# EAGLE design EPaperDisplayUnit (EAGLE 7.5.0)
GCN: 1.0; PCBNAME: EPaperDisplayUnit; PROJECT: EPaperDisplayUnit

## Sheet 1 of 2
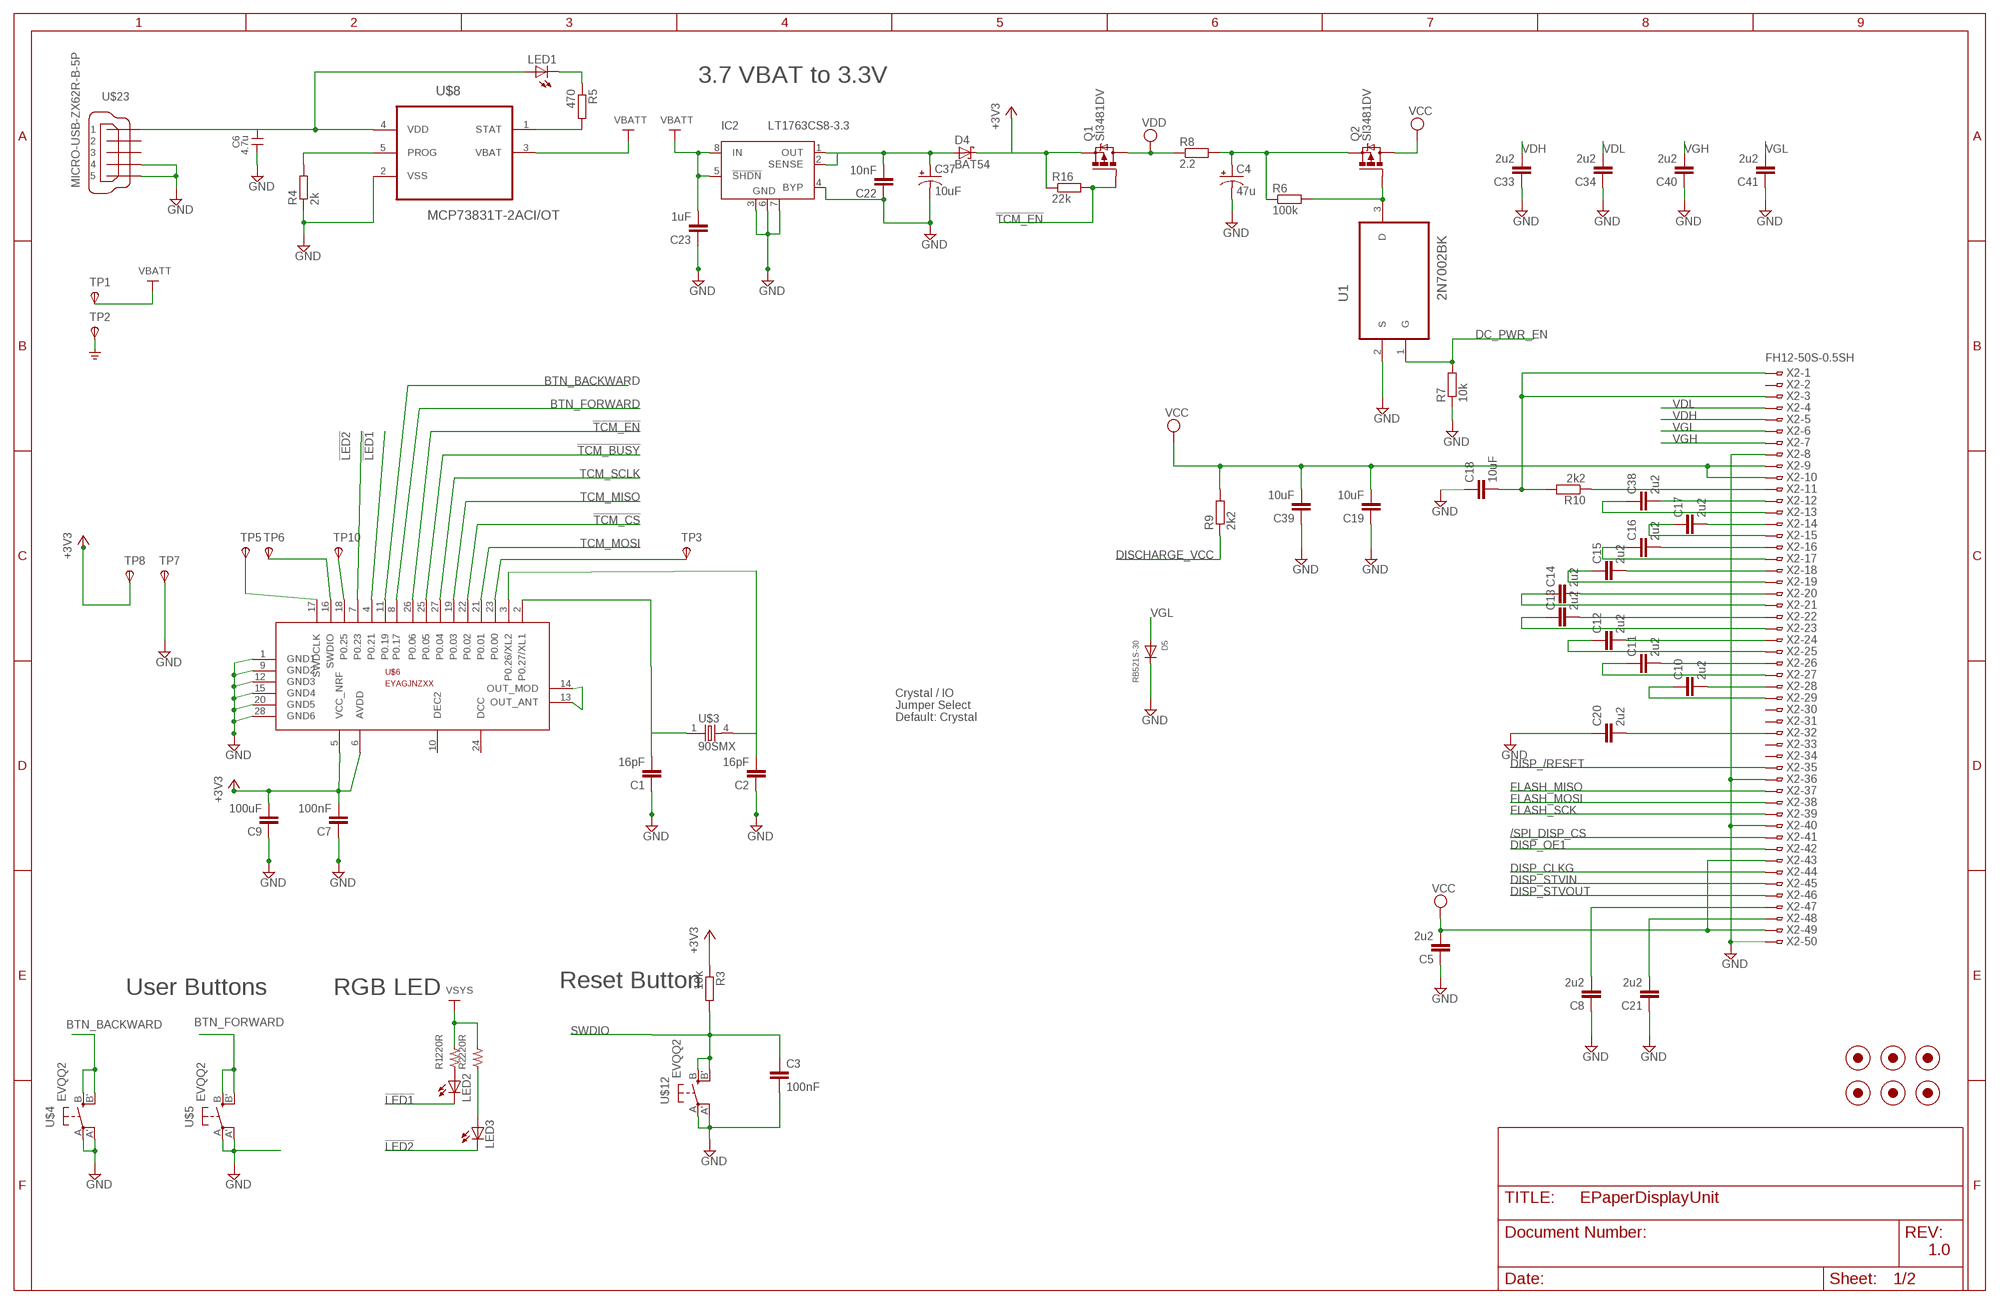
[diagram p0: schematic, sheet 1]

### Parts
C1  16pF  C-EUC0402  [C0402]
C2  16pF  C-EUC0402  [C0402]
C3  100nF  C-EUC0603  [C0603]
C4  47u  CPOL-USB/3528-21R  [B/3528-21R]
C5  2u2  C-EUC0402  [C0402]
C6  4.7u  C-0603  [SMD0603]
C7  100nF  C-EUC0402  [C0402]
C8  2u2  C-EUC0402  [C0402]
C9  100uF  C-EUC0402  [C0402]
C10  2u2  C-EUC0402  [C0402]
C11  2u2  C-EUC0402  [C0402]
C12  2u2  C-EUC0402  [C0402]
C13  2u2  C-EUC0402  [C0402]
C14  2u2  C-EUC0402  [C0402]
C15  2u2  C-EUC0402  [C0402]
C16  2u2  C-EUC0402  [C0402]
C17  2u2  C-EUC0402  [C0402]
C18  10uF  C-EUC0402  [C0402]
C19  10uF  C-EUC0402  [C0402]
C20  2u2  C-EUC0402  [C0402]
C21  2u2  C-EUC0402  [C0402]
C22  10nF  C-EUC0402  [C0402]
C23  1uF  C-EUC0402  [C0402]
C33  2u2  C-EUC0402  [C0402]
C34  2u2  C-EUC0402  [C0402]
C37  10uF  CPOL-US085CS-1AR  [085CS_1AR]
C38  2u2  C-EUC0402  [C0402]
C39  10uF  C-EUC0402  [C0402]
C40  2u2  C-EUC0402  [C0402]
C41  2u2  C-EUC0402  [C0402]
D4  BAT54  [SOT23]
D5  RB521S-30  DIODESOD-523  [SOD-523]
FID1  FIDUCIAL-.04  [FIDUCIAL-.04]
FID2  FIDUCIAL-.04  [FIDUCIAL-.04]
FID3  FIDUCIAL-.04  [FIDUCIAL-.04]
FID4  FIDUCIAL-.04  [FIDUCIAL-.04]
FID5  FIDUCIAL-.04  [FIDUCIAL-.04]
FID6  FIDUCIAL-.04  [FIDUCIAL-.04]
IC2  LT1763CS8-3.3  [SOIC8]
LED1  LEDCHIPLED_0603  [CHIPLED_0603]
LED2  LEDCHIP-LED0603  [CHIP-LED0603]
LED3  LEDCHIP-LED0603  [CHIP-LED0603]
Q1  SI3481DV  [TSOP-6.PAC]
Q2  SI3481DV  [TSOP-6.PAC]
R1  220R  R-0402  [SMD0402]
R2  220R  R-0402  [SMD0402]
R3  10k  R-EU_R0402  [R0402]
R4  2k  R-EU_R0402  [R0402]
R5  470  R-EU_R0402  [R0402]
R6  100k  R-EU_R0402  [R0402]
R7  10k  R-EU_R0402  [R0402]
R8  2.2  R-EU_R0402  [R0402]
R9  2k2  R-EU_R0402  [R0402]
R10  2k2  R-EU_R0402  [R0402]
R16  22k  R-EU_R0402  [R0402]
TP1  TPSPAD1-13Y  [P1-13Y]
TP2  TPSPAD1-13Y  [P1-13Y]
TP3  TPSPAD1-13Y  [P1-13Y]
TP5  TPSPAD1-13Y  [P1-13Y]
TP6  TPSPAD1-13Y  [P1-13Y]
TP7  TPSPAD1-13Y  [P1-13Y]
TP8  TPSPAD1-13Y  [P1-13Y]
TP10  TPSPAD1-13Y  [P1-13Y]
U1  2N7002BK  [SOT95P230X110-3N]
U$3  90SMX  [9XSMX]
U$4  EVQQ2  [EVQ-Q2]
U$5  EVQQ2  [EVQ-Q2]
U$6  EYAGJNZXXEYAGJNZXX  [EYAGJNZXX]
U$8  MCP73831T-2ACI/OT  [SOT95P280X145-5N]
U$12  EVQQ2  [EVQ-Q2]
U$23  MICRO-USB-ZX62R-B-5P  [ZX62R-B-5P]
X2  FH12-50S-0.5SH  [FH12-50S-0.5SH]

### Nets
!LED1: LED2.C U$6.4(P0.21)
!LED2: LED3.C U$6.7(P0.23)
!TCM_BUSY: U$6.25(P0.05) ; also sheet 2
!TCM_CS: U$6.22(P0.02) ; also sheet 2
!TCM_EN: Q1.3(G) R16.2 U$6.26(P0.06)
+3V3: C7.2 C9.2 D4.3(C) Q1.4(S) R3.1 R16.1 TP8.TP(PP) U$6.5(VCC_NRF) U$6.6(AVDD)
/SPI_DISP_CS: X2.41 ; also sheet 2
BTN_BACKWARD: U$4.B'(S1) U$4.B(S) U$6.11(P0.19)
BTN_FORWARD: U$5.B'(S1) U$5.B(S) U$6.8(P0.17)
DC_PWR_EN: R7.2 U1.1(G) ; also sheet 2
DISCHARGE_VCC: R9.1 ; also sheet 2
DISP_/RESET: X2.35 ; also sheet 2
DISP_CLKG: X2.44 ; also sheet 2
DISP_OE1: X2.42 ; also sheet 2
DISP_STVIN: X2.45 ; also sheet 2
DISP_STVOUT: X2.46 ; also sheet 2
FLASH_MISO: X2.37 ; also sheet 2
FLASH_MOSI: X2.38 ; also sheet 2
FLASH_SCK: X2.39 ; also sheet 2
GND [Planes]: C1.1 C2.1 C3.2 C4.- C5.1 C6.2 C7.1 C8.1 C9.1 C18.1 C19.1 C20.1 C21.1 C22.1 C23.1 C33.1 C34.1 C37.- C39.1 C40.1 C41.1 D5.K(C) IC2.3(GND) IC2.4(BYP) IC2.6(GND) IC2.7(GND) R4.1 R7.1 TP2.TP(PP) TP7.TP(PP) U$4.A'(P1) U$4.A(P) U$5.A'(P1) U$5.A(P) U$6.1(GND1) U$6.9(GND2) U$6.12(GND3) U$6.15(GND4) U$6.20(GND5) U$6.28(GND6) U$8.2(VSS) U$12.A'(P1) U$12.A(P) U$23.4 U$23.5 X2.8 X2.36 X2.40 X2.50 ; also sheet 2
N$1: TP10.TP(PP) U$6.18(P0.25)
N$5: C6.1 LED1.A U$8.4(VDD) U$23.1
N$6: C22.2 C37.+ D4.1(A) IC2.1(OUT) IC2.2(SENSE)
N$7: R4.2 U$8.5(PROG)
N$8: LED1.C R5.1
N$9 [Planes]: C20.2 X2.32
N$10: R5.2 U$8.1(STAT)
N$11: Q2.3(G) R6.2 U1.3(D)
N$12: C4.+ Q2.4(S) R6.1 R8.2
N$13: C10.1 X2.29
N$14: C10.2 X2.28
N$15: C11.1 X2.27
N$16: C11.2 X2.26
N$17: C12.1 X2.25
N$18: C12.2 X2.24
N$19: C2.2 U$3.4 U$6.3(P0.26/XL2)
N$20: C1.2 U$3.1 U$6.2(P0.27/XL1)
N$21: C13.1 X2.23
N$22: C13.2 X2.22
N$24: C14.1 X2.21
N$25: C14.2 X2.20
N$26: C15.1 X2.19
N$27: C16.1 X2.17
N$28: C16.2 X2.16
N$29: C17.1 X2.15
N$30: C17.2 X2.14
N$31: C38.1 X2.13
N$32: C38.2 X2.12
N$33: LED2.A R1.1
N$34: LED3.A R2.1
N$36: C18.2 R10.2 X2.1 X2.3
N$37: R10.1 X2.11
N$38: TP3.TP(PP) U$6.23(P0.00)
N$39: C15.2 X2.18
N$44: U$6.13(OUT_ANT) U$6.14(OUT_MOD)
SWCLK: TP5.TP(PP) U$6.17(SWDCLK)
SWDIO: C3.1 R3.2 TP6.TP(PP) U$6.16(SWDIO) U$12.B'(S1) U$12.B(S)
TCM_MISO: U$6.19(P0.03) ; also sheet 2
TCM_MOSI: U$6.21(P0.01) ; also sheet 2
TCM_SCLK: U$6.27(P0.04) ; also sheet 2
VBATT: C23.2 IC2.5(!SHDN) IC2.8(IN) TP1.TP(PP) U$8.3(VBAT)
VCC: C5.2 C19.2 C39.2 Q2.1(D) Q2.2(D) Q2.5(D) Q2.6(D) R9.2 X2.9 X2.10 X2.43 X2.49
VDD: Q1.1(D) Q1.2(D) Q1.5(D) Q1.6(D) R8.1 ; also sheet 2
VDH: C33.2 X2.5
VDL: C34.2 X2.4
VGH: C21.2 C40.2 X2.7 X2.48
VGL: C8.2 C41.2 D5.A X2.6 X2.47
VSYS: R1.2 R2.2
Unconnected: U1.2(S) U$6.10(DEC2) U$6.24(DCC) U$23.2 U$23.3 X2.2 X2.30 X2.31 X2.33 X2.34

### Notes on the sheet
- 3.7 VBAT to 3.3V
- Crystal / IO
  Jumper Select
  Default: Crystal
- User Buttons | RGB LED | Reset Button
- 1.0

## Sheet 2 of 2
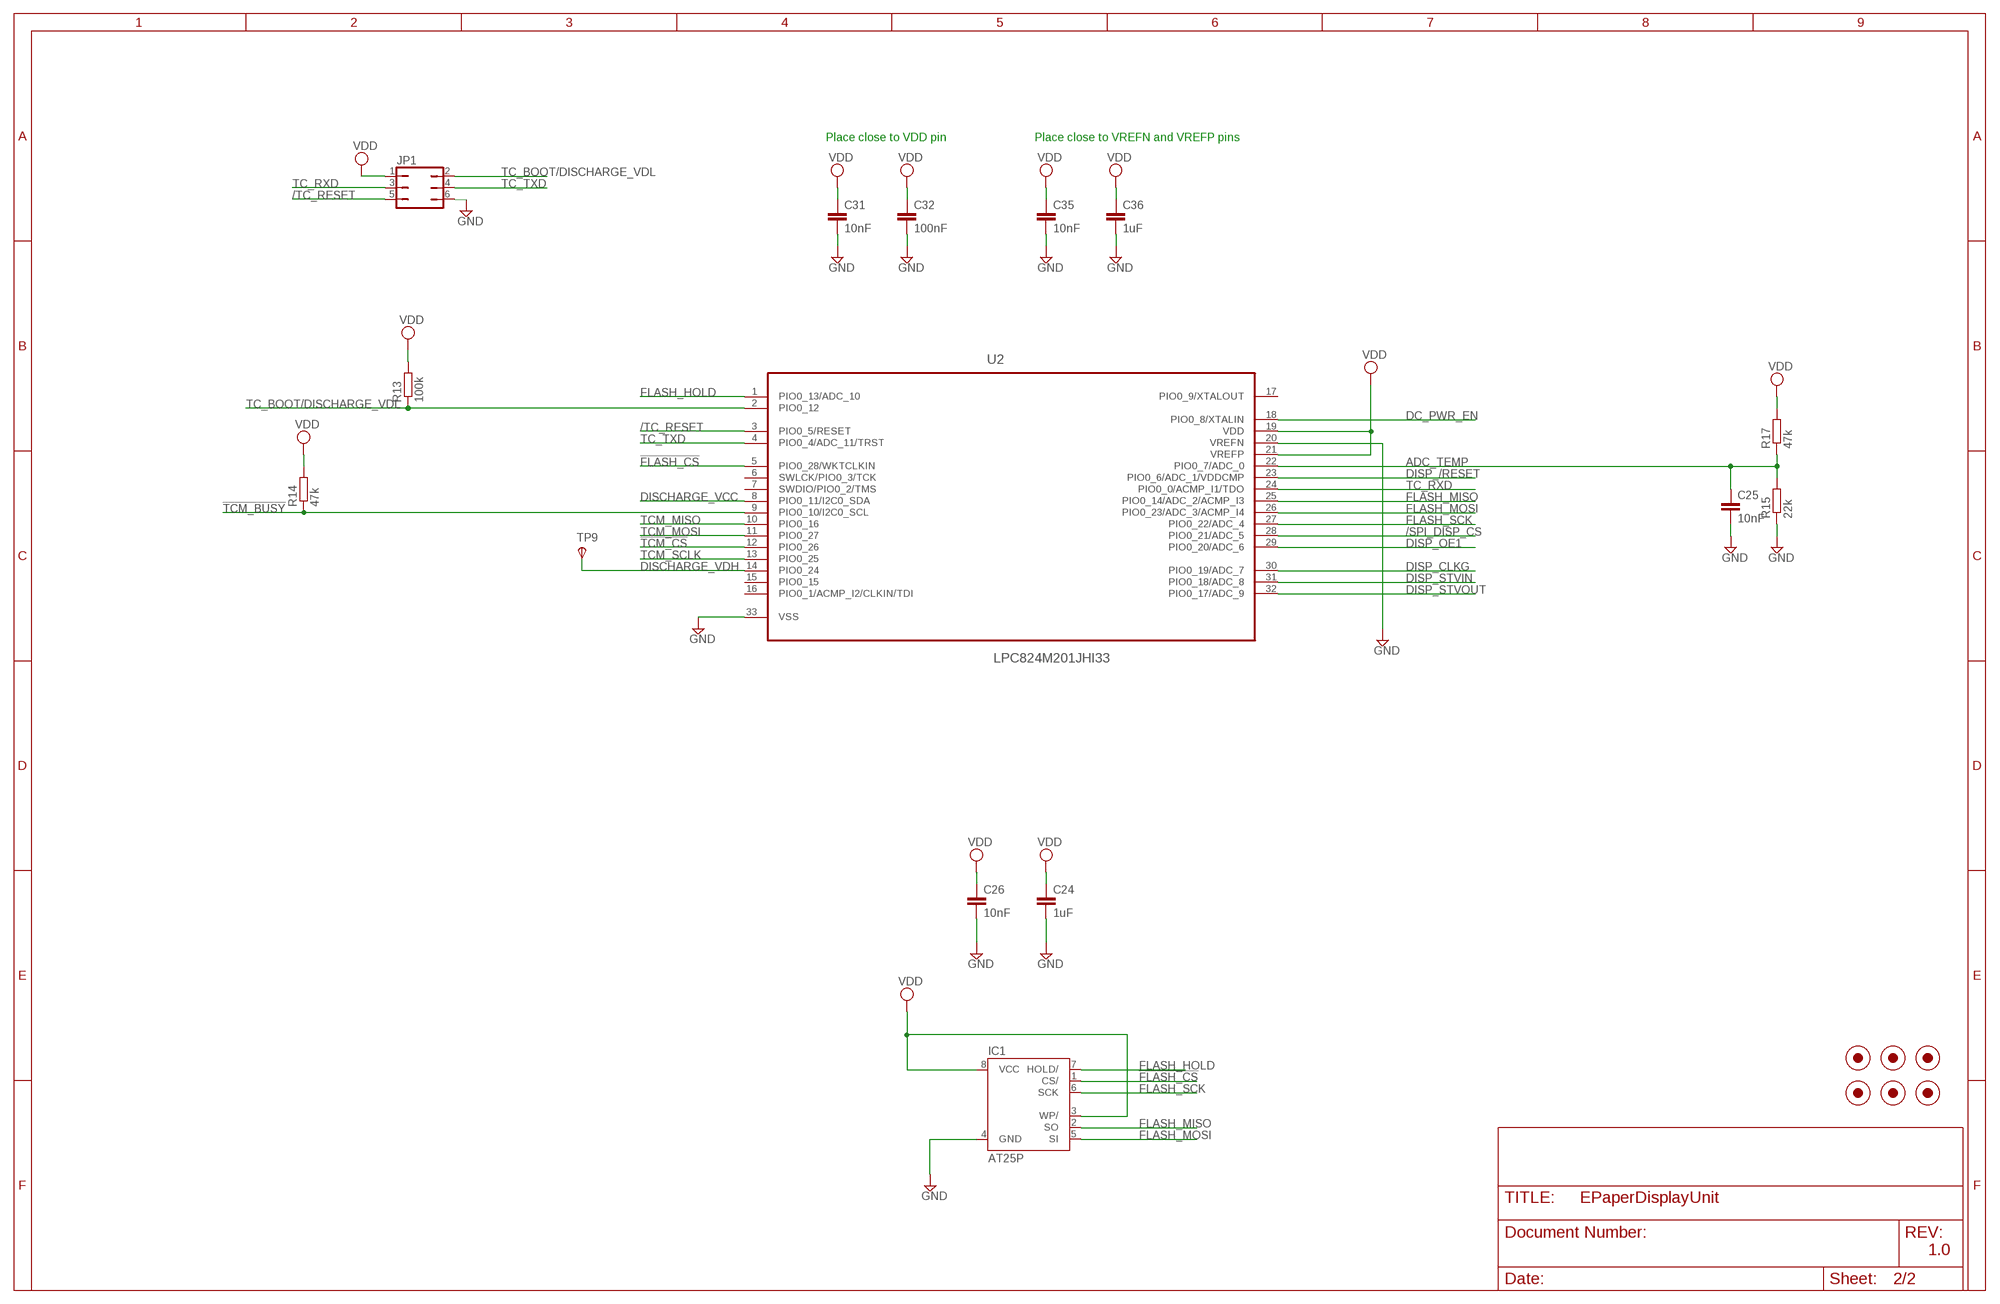
[diagram p1: schematic, sheet 2]

### Parts
C24  1uF  CC0402  [C0402]
C25  10nF  C-EUC0402  [C0402]
C26  10nF  CC0402  [C0402]
C31  10nF  C-EUC0402  [C0402]
C32  100nF  C-EUC0402  [C0402]
C35  10nF  C-EUC0402  [C0402]
C36  1uF  C-EUC0402  [C0402]
FID7  FIDUCIAL-.04  [FIDUCIAL-.04]
FID8  FIDUCIAL-.04  [FIDUCIAL-.04]
FID9  FIDUCIAL-.04  [FIDUCIAL-.04]
FID10  FIDUCIAL-.04  [FIDUCIAL-.04]
FID11  FIDUCIAL-.04  [FIDUCIAL-.04]
FID12  FIDUCIAL-.04  [FIDUCIAL-.04]
IC1  AT25P  [DIL08]
JP1  JP3Q  [JP3Q]
R13  100k  R-EU_R0402  [R0402]
R14  47k  R-EU_R0402  [R0402]
R15  22k  R-EU_R0402  [R0402]
R17  47k  R-EU_R0402  [R0402]
TP9  TPSPAD1-13Y  [P1-13Y]
U2  LPC824M201JHI33  [QFN65P700X700X100-33N]

### Nets
!FLASH_CS: IC1.1(CS/) U2.5(PIO0_28/WKTCLKIN)
!TCM_BUSY: R14.1 U2.9(PIO0_10/I2C0_SCL) ; also sheet 1
!TCM_CS: U2.12(PIO0_26) ; also sheet 1
/SPI_DISP_CS: U2.28(PIO0_21/ADC_5) ; also sheet 1
/TC_RESET: JP1.5 U2.3(PIO0_5/RESET)
ADC_TEMP: C25.1 R15.2 R17.1 U2.22(PIO0_7/ADC_0)
DC_PWR_EN: U2.18(PIO0_8/XTALIN) ; also sheet 1
DISCHARGE_VCC: U2.8(PIO0_11/I2C0_SDA) ; also sheet 1
DISCHARGE_VDH: TP9.TP(PP) U2.14(PIO0_24)
DISP_/RESET: U2.23(PIO0_6/ADC_1/VDDCMP) ; also sheet 1
DISP_CLKG: U2.30(PIO0_19/ADC_7) ; also sheet 1
DISP_OE1: U2.29(PIO0_20/ADC_6) ; also sheet 1
DISP_STVIN: U2.31(PIO0_18/ADC_8) ; also sheet 1
DISP_STVOUT: U2.32(PIO0_17/ADC_9) ; also sheet 1
FLASH_HOLD: IC1.7(HOLD/) U2.1(PIO0_13/ADC_10)
FLASH_MISO: IC1.2(SO) U2.25(PIO0_14/ADC_2/ACMP_I3) ; also sheet 1
FLASH_MOSI: IC1.5(SI) U2.26(PIO0_23/ADC_3/ACMP_I4) ; also sheet 1
FLASH_SCK: IC1.6(SCK) U2.27(PIO0_22/ADC_4) ; also sheet 1
GND [Planes]: C24.2 C25.2 C26.2 C31.2 C32.2 C35.2 C36.2 IC1.4(GND) JP1.6 R15.1 U2.20(VREFN) U2.33(VSS) ; also sheet 1
TC_BOOT/DISCHARGE_VDL: JP1.2 R13.1 U2.2(PIO0_12)
TC_RXD: JP1.3 U2.24(PIO0_0/ACMP_I1/TDO)
TC_TXD: JP1.4 U2.4(PIO0_4/ADC_11/TRST)
TCM_MISO: U2.10(PIO0_16) ; also sheet 1
TCM_MOSI: U2.11(PIO0_27) ; also sheet 1
TCM_SCLK: U2.13(PIO0_25) ; also sheet 1
VDD: C24.1 C26.1 C31.1 C32.1 C35.1 C36.1 IC1.3(WP/) IC1.8(VCC) JP1.1 R13.2 R14.2 R17.2 U2.19(VDD) U2.21(VREFP) ; also sheet 1
Unconnected: U2.6(SWLCK/PIO0_3/TCK) U2.7(SWDIO/PIO0_2/TMS) U2.15(PIO0_15) U2.16(PIO0_1/ACMP_I2/CLKIN/TDI) U2.17(PIO0_9/XTALOUT)

### Notes on the sheet
- Place close to VDD pin | Place close to VREFN and VREFP pins
- 1.0

## Library data of the parts
C1-C3 C5 C7-C23 C25 C31-C36 C38-C41 = rcl:C-EU: CAPACITOR, European symbol
C4 C37 = adafruit:CPOL-US: POLARIZED CAPACITOR, American symbol
C6 = c:C; DESCRIPTION: CAP CER 4.7UF 6.3V 10% X5R 0603; EACH: 0.022; MFPN: GRM188R60J475KE19D; MFR: Murata; VEND: Digikey; VPN: 490-3297-1-ND
C24 C26 = eagle-ltspice:C: CAPACITOR, European symbol; SPICEMODEL: NONE; SPICEPREFIX: C
D4 = diode:BAT54: Schottky Diodes Source: Fairchild .. BAT54.pdf
D5 = adafruit:DIODE: Diode SMADIODE - SMA Surface Mount Package 20V 1A Schottky Diode Digikey: 641-1014-6-ND DO-1N4148 - Through Hole Small Current Diode SOD-123 20V 1 A (.5mV Vf) Schottky Diode - Digikey: MBRX120TPMSCT-ND SOD-323 10V 570mA (.38mV Vf, 3ns) Schottky Diode - Digikey: ZLLS410CT-ND SOD-523 30V 30mA Schottky Diode (RB751S-40TE61) - Digikey: RB751S-40TE61CT-ND SOT23-R/W - SOT23 Package (R = Solder Paste/Reflow Ovens, W = Hand-Soldering) BAT54Film 40V 300mA - Digikey: 497-7162-1-ND
FID1-FID12 = rigado-pcb:FIDUCIAL
IC1 = atmel:AT25*: SPI bus serial EEPROM; MPN: CAT25040LI-G; OC_FARNELL: 1718045; OC_NEWARK: 06R0588
IC2 = linear-technology:LT1763CS8: 500mA, Low Noise, LDO Micropower Regulators Source: http://cds.linear.com/docs/Datasheet/1763ff.pdf; MPN: LT1763CS8-3.3; OC_FARNELL: 1273617; OC_NEWARK: 57M6055
JP1 = jumper:JP3Q: JUMPER
LED1-LED3 = led:LED: LED OSRAM: - CHIPLED LG R971, LG N971, LY N971, LG Q971, LY Q971, LO R971, LY R971 LH N974, LH R974 LS Q976, LO Q976, LY Q976 LO Q996 - Hyper CHIPLED LW Q18S LB Q993, LB Q99A, LB R99A - SideLED LS A670, LO A670, LY A670, LG A670, LP A670 LB A673, LV A673, LT A673, LW A673 LH A674 LY A675 LS A676, LA A676, LO A676, LY A676, LW A676 LS A679, LY A679, LG A679 - Hyper Micro SIDELED® LS Y876, LA Y876, LO Y876, LY Y876 LT Y87S - SmartLED LW L88C, LW L88S LB L89C, LB L89S, LG L890 LS L89K, LO L89K, LY L89K LS L896, LA L896, LO L896, LY L896 - TOPLED LS T670, LO T670, LY T670, LG T670, LP T670 LSG T670, LSP T670, LSY T670, LOP T670, LYG T670 LG T671, LOG T671, LSG T671 LB T673, LV T673, LT T673, LW T673 LH T674 LS T676, LA T676, LO T676, LY T676, LB T676, LH T676, LSB T676, LW T676 LB T67C, LV T67C, LT T67C, LS T67K, LO T67K, LY T67K, LW E67C LS E67B, LA E67B, LO E67B, LY E67B, LB E67C, LV E67C, LT E67C LW T67C LS T679, LY T679, LG T679 LS T770, LO T770, LY T770, LG T770, LP T770 LB T773, LV T773, LT T773, LW T773 LH T774 LS E675, LA E675, LY E675, LS T675 LS T776, LA T776, LO T776, LY T776, LB T776 LHGB T686 LT T68C, LB T68C - Hyper Mini TOPLED® LB M676 - Mini TOPLED Santana® LG M470 LS M47K, LO M47K, LY M47K Source: http://www.osram.convergy.de LUXEON: - LUMILED® LXK2-PW12-R00, LXK2-PW12-S00, LXK2-PW14-U00, LXK2-PW14-V00 LXK2-PM12-R00, LXK2-PM12-S00, LXK2-PM14-U00 LXK2-PE12-Q00, LXK2-PE12-R00, LXK2-PE12-S00, LXK2-PE14-T00, LXK2-PE14-U00 LXK2-PB12-K00, LXK2-PB12-L00, LXK2-PB12-M00, LXK2-PB14-N00, LXK2-PB14-P00, LXK2-PB14-Q00 LXK2-PR12-L00, LXK2-PR12-M00, LXK2-PR14-Q00, LXK2-PR14-R00 LXK2-PD12-Q00, LXK2-PD12-R00, LXK2-PD12-S00 LXK2-PH12-R00, LXK2-PH12-S00 LXK2-PL12-P00, LXK2-PL12-Q00, LXK2-PL12-R00 Source: www.luxeon.com KINGBRIGHT: KA-3528ASYC Source: www.kingbright.com
Q1 Q2 = transistor-power:SI3481DV: P-Channel 30-V (D-S) MOSFET Source: http://www.vishay.com/docs/72105/72105.pdf
R1 R2 = r:R; DESCRIPTION: RES 220 OHM 1/16W 5% 0402; EACH: 0.0023; MFPN: RC1005J221CS; MFR: Samsung; VEND: Digikey; VPN: 1276-4360-1-ND
R3-R10 R13-R17 = resistor:R-EU_: RESISTOR, European symbol
TP1-TP3 TP5-TP10 = testpad:TPS: TEST PIN
U1 = NXP_By_element14_Batch_1:2N7002BK: MOSFET; MPN: 2N7002BK; OC_FARNELL: 1859847; OC_NEWARK: 28T0305; PACKAGE: SOT-23-3; SUPPLIER: NXP
U2 = NXP_By_element14_Batch_1:LPC824M201JHI33: 32-bit ARM Cortex-M0 microcontroller up to 32 kB flash and 8 kB SRAM; MPN: LPC1114FHN33/201,5; OC_FARNELL: -; OC_NEWARK: 70R5584; PACKAGE: HVQFN-32; SUPPLIER: NXP
U$3 = crystal:90SMX
U$4 U$5 U$12 = adafruit:EVQQ2: SMT 6mm switch, EVQQ2 series http://www.ladyada.net/library/eagle
U$6 = TAIYO-YUDEN:EYAGJNZXX: Wireless Module: ANTTM + Bluetooth® Smart (BLE) Frequency: 2402 to 2480 MHz Output power: +4dBm typ. Single power supply: 1.8 – 3.6V ANTTM + Single Mode Bluetooth® Smart Slave Integrated System Clock Integrated high performance pattern antenna ARM Cortex M0 32bit processor and 256KB flash and 32KB RAM Interface: SPI, UART, I2C and 8/9/10bit ADC Outline: 5.1 x 11.3 x 1.3 mm MAX Bluetooth® and Japan, FCC, IC qualified RoHS compliant / Complete Lead Free
U$8 = MICROCHIP-MCP73831T:MCP73831T-2ACI/OT: Charge Management Controller; MPN: MCP73831T-2ACI/OT; OC_FARNELL: 1332158; OC_NEWARK: 56K7045; PACKAGE: SOT-5; SUPPLIER: Microchip
U$23 = con-hirose:MICRO-USB-: Hirose Micro USB Connector ZX62R-B-5P: Micro B, reverse (top mount) shell SMT Supplier: DigiKey H11574CT-ND Source: http://www.hirose.co.jp/cataloge_hp/e24200011.pdf; MANUFACTURE-PN: ZX62R-B-5P; OC_FARNELL: 2300439; PRICE-10-OFF: £0.906; PRICE-100-OFF: £0.658
X2 = con-hirose:FH12-50S-0.5S: 0.5mm Pitch Connectors For FPC/FFC Source: Data sheet <http://www.hirose.co.jp/cataloge_hp/e58605370.pdf>; MPN: FH12-50S-0.5SH(55); OC_FARNELL: 1324557; OC_NEWARK: 34M6181

## Net classes
0 default: width 0.2 mm, drill 0.2 mm, clearance 0.2 mm
1 usb: width 0.356 mm, clearance 0.254 mm to class 0
6 Planes: clearance 0.508 mm to class 1

## Board
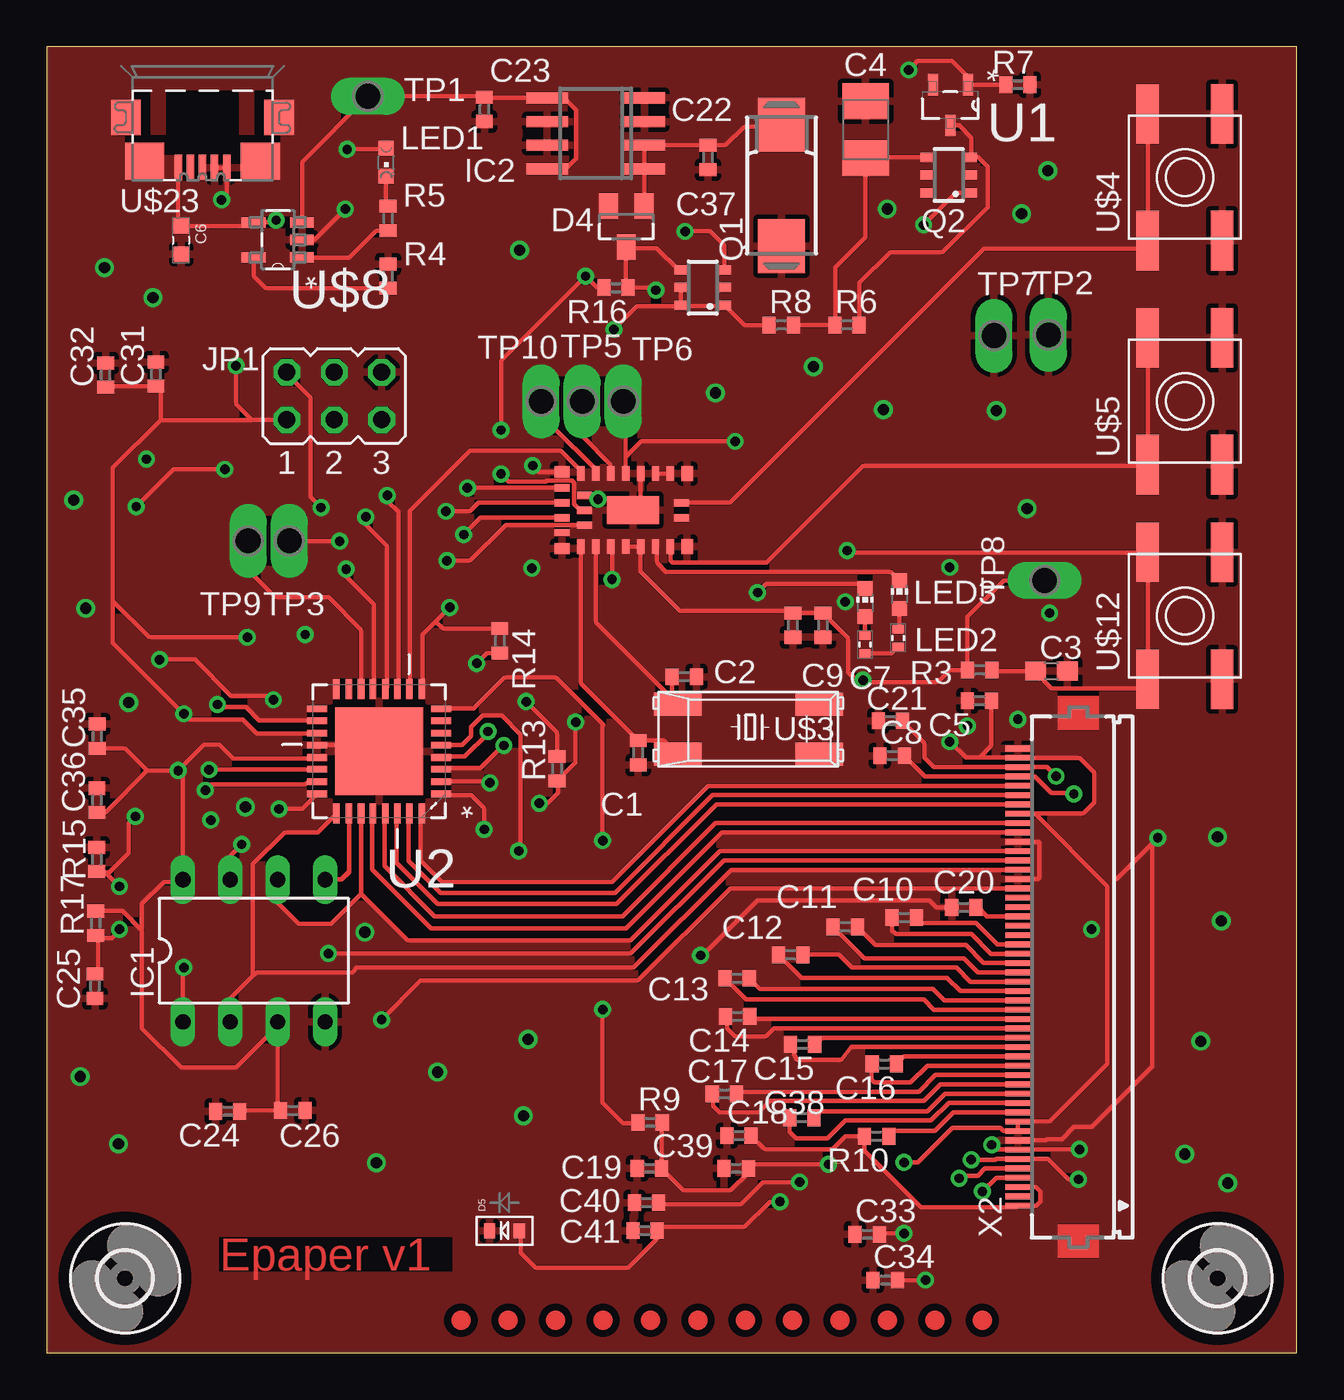
[diagram p2: board, top side]
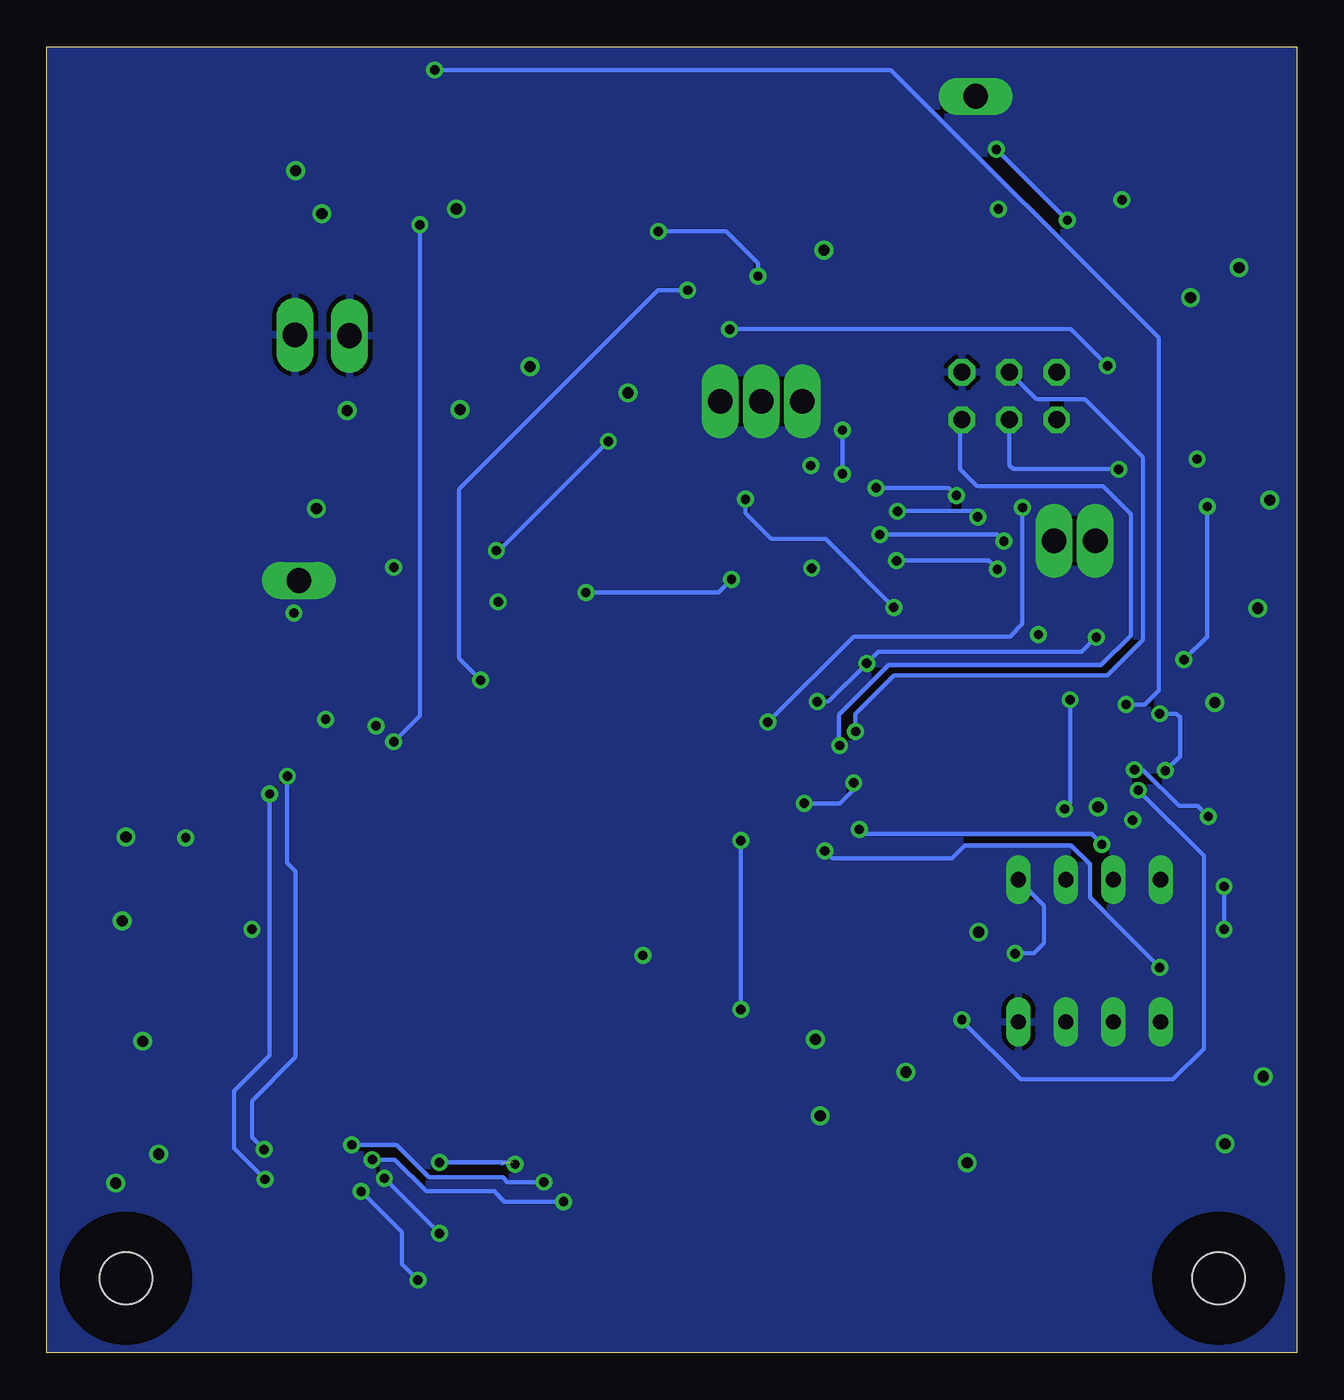
[diagram p3: board, bottom side, seen from below]

Size 67 x 70 mm. Coordinates in mm from the lower left corner, seen from the top.
Outline: 0,0 67,0 67,70 0,70 0,0
Copper layers (1*16): Top 0.035mm / dielectric 1.5mm / Bottom 0.035mm
Design rules "default *": minimum track width 0.002540625mm, minimum drill 0.00508125mm, track to track 0.000253125mm, track to pad 0.000253125mm, pad to pad 0.000253125mm, via to via 0.000253125mm, smd to smd 0.000253125mm, copper to edge 0.000253125mm, drill to drill 0.000253125mm, minimum pad ring 10mil, minimum via ring 8mil, stop-mask expansion 4mil, vias tented up to drill 0mil, thermal gap 10mil

### Footprints (pad centres in the part's own frame; a part is rotated, then mirrored left to right if it is on the bottom)
C0402 = smd 0.7 x 0.9: 1 -0.65,0; 2 0.65,0
C0603 = smd 1.1 x 1: 1 -0.85,0; 2 0.85,0
B/3528-21R = smd 1.95 x 2.5: + 1.525,0; - -1.525,0
SMD0603 = smd 0.8 x 0.8: 1 -0.75,0; 2 0.75,0
085CS_1AR = smd 2.9 x 2.5: + 3.25,0; - -3.25,0
SOT23 = smd 1 x 1.4: 1 -0.95,-1.1; 2 0.95,-1.1; 3 0,1.1
SOD-523 = smd 0.8 x 0.6: A 0,-0.8; K 0,0.8
DIL08 = drill 0.813 long: 1 -3.81,-3.81; 2 -1.27,-3.81; 3 1.27,-3.81; 4 3.81,-3.81; 5 3.81,3.81; 6 1.27,3.81; 7 -1.27,3.81; 8 -3.81,3.81
SOIC8 = smd 0.6 x 2.2: 1 -1.905,-2.6; 2 -0.635,-2.6; 3 0.635,-2.6; 4 1.905,-2.6; 5 1.905,2.6; 6 0.635,2.6; 7 -0.635,2.6; 8 -1.905,2.6
JP3Q = drill 0.914 octagon: 1 -2.54,-1.27; 2 -2.54,1.27; 3 0,-1.27; 4 0,1.27; 5 2.54,-1.27; 6 2.54,1.27
CHIPLED_0603 = smd 0.8 x 0.8: A 0,-0.75; C 0,0.75
CHIP-LED0603 = smd 0.8 x 0.8: A 0,-0.75; C 0,0.75
TSOP-6.PAC = smd 0.508 x 0.7: 1 -0.95,-1.163; 2 0,-1.163; 3 0.95,-1.163; 4 0.95,1.163; 5 0,1.163; 6 -0.95,1.163
SMD0402 = smd 0.45 x 0.6: 1 -0.475,0; 2 0.475,0
R0402 = smd 0.7 x 0.9: 1 -0.65,0; 2 0.65,0
P1-13Y = drill 1.321 pad 1.905 long: TP 0,0
SOT95P230X110-3N = smd 1.168 x 0.533: 1 -1.092,0.94; 2 -1.092,-0.94; 3 1.092,0
QFN65P700X700X100-33N = smd 1.067 x 0.356: 1 -3.327,2.286; 2 -3.327,1.626; 3 -3.327,0.965; 4 -3.327,0.33; 5 -3.327,-0.33; 6 -3.327,-0.965; 7 -3.327,-1.626; 8 -3.327,-2.286; 17 3.327,-2.286; 18 3.327,-1.626; 19 3.327,-0.965; 20 3.327,-0.33; 21 3.327,0.33; 22 3.327,0.965; 23 3.327,1.626; 24 3.327,2.286 | smd 0.356 x 1.067: 9 -2.286,-3.327; 10 -1.626,-3.327; 11 -0.965,-3.327; 12 -0.33,-3.327; 13 0.33,-3.327; 14 0.965,-3.327; 15 1.626,-3.327; 16 2.286,-3.327; 25 2.286,3.327; 26 1.626,3.327; 27 0.965,3.327; 28 0.33,3.327; 29 -0.33,3.327; 30 -0.965,3.327; 31 -1.626,3.327; 32 -2.286,3.327 | smd 4.699 x 4.699: 33 0,0
2,8 = hole 2.8: 0,0
9XSMX = smd 2.54 x 1.27: 1 0.72,0.66; 2 8.31,0.66; 3 8.31,3.34; 4 0.72,3.34
EVQ-Q2 = smd 3.2 x 1.2: A -3.4,-2; A' 3.4,-2; B -3.4,2; B' 3.4,2
EYAGJNZXX = smd 0.8 x 0.6: 1 -3.8,-2.05; 20 -3.8,2.05 | smd 0.4 x 0.8: 2 -2.8,-1.95; 3 -2,-1.95; 4 -1.2,-1.95; 5 -0.4,-1.95; 6 0.4,-1.95; 7 1.2,-1.95; 8 2,-1.95; 13 2,1.95; 14 1.2,1.95; 15 0.4,1.95; 16 -0.4,1.95; 17 -1.2,1.95; 18 -2,1.95; 19 -2.8,1.95 | smd 0.6 x 0.8: 9 2.9,-1.95; 12 2.9,1.95 | smd 0.8 x 0.4: 10 2.6,-0.4; 11 2.6,0.4; 21 -3.8,1.2; 22 -3.8,0.4; 23 -3.8,-0.4; 24 -3.8,-1.2; 25 -2.6,0.8; 26 -2.6,0; 27 -2.6,-0.8 | smd 2.8 x 1.5: 28 0,0
SOT95P280X145-5N = smd 1.27 x 0.559: 1 -1.295,0.94; 2 -1.295,0; 3 -1.295,-0.94; 4 1.295,-0.94; 5 1.295,0.94
ZX62R-B-5P = smd 1.35 x 0.4: 1 2.675,-1.3; 2 2.675,-0.65; 3 2.675,0; 4 2.675,0.65; 5 2.675,1.3 | smd 1.9 x 1.6: M1 0,-4.1; M2 0,4.1 | smd 2 x 2.1: M3 2.35,3.1; M4 2.35,-3.1
FH12-50S-0.5SH = smd 0.3 x 1.3: 1 -12.25,3.25; 2 -11.75,3.25; 3 -11.25,3.25; 4 -10.75,3.25; 5 -10.25,3.25; 6 -9.75,3.25; 7 -9.25,3.25; 8 -8.75,3.25; 9 -8.25,3.25; 10 -7.75,3.25; 11 -7.25,3.25; 12 -6.75,3.25; 13 -6.25,3.25; 14 -5.75,3.25; 15 -5.25,3.25; 16 -4.75,3.25; 17 -4.25,3.25; 18 -3.75,3.25; 19 -3.25,3.25; 20 -2.75,3.25; 21 -2.25,3.25; 22 -1.75,3.25; 23 -1.25,3.25; 24 -0.75,3.25; 25 -0.25,3.25; 26 0.25,3.25; 27 0.75,3.25; 28 1.25,3.25; 29 1.75,3.25; 30 2.25,3.25; 31 2.75,3.25; 32 3.25,3.25; 33 3.75,3.25; 34 4.25,3.25; 35 4.75,3.25; 36 5.25,3.25; 37 5.75,3.25; 38 6.25,3.25; 39 6.75,3.25; 40 7.25,3.25; 41 7.75,3.25; 42 8.25,3.25; 43 8.75,3.25; 44 9.25,3.25; 45 9.75,3.25; 46 10.25,3.25; 47 10.75,3.25; 48 11.25,3.25; 49 11.75,3.25; 50 12.25,3.25

### Placement (x,y rotation side)
C1  31.7,32.16 90 top
C2  34.17,36.23 180 top
C3  53.85,36.54 0 top
C4  43.89,65.55 270 top
C5  49.99,34.95 0 top
C6  7.2,59.62 270 top
C7  41.6,39 90 top
C8  45.31,32 0 top
C9  39.99,39 90 top
C10  45.96,23.33 180 top
C11  42.79,22.83 180 top
C12  39.87,21.33 180 top
C13  37,20.08 180 top
C14  37.03,18.03 180 top
C15  40.51,16.53 180 top
C16  44.89,15.48 180 top
C17  36.32,13.88 180 top
C18  37.1,11.64 0 top
C19  32.3,9.89 0 top
C20  49.15,23.87 0 top
C21  45.22,33.87 0 top
C22  35.44,64.06 90 top
C23  23.46,66.64 90 top
C24  9.7,12.95 180 top
C25  2.59,19.65 270 top
C26  13.2,12.99 0 top
C31  5.86,52.45 90 top
C32  3.16,52.4 90 top
C33  43.97,6.35 0 top
C34  44.94,3.9 0 top
C35  2.71,33.05 90 top
C36  2.7,29.61 90 top
C37  39.38,62.56 90 top
C38  40.47,12.6 180 top
C39  36.95,9.89 0 top
C40  32.15,8.05 0 top
C41  32.07,6.55 0 top
D4  31.06,60.35 180 top
D5  24.53,6.55 90 top
FID1  50.14,1.75 0 top
FID2  47.6,1.75 0 top
FID3  45.06,1.75 0 top
FID4  42.52,1.75 0 top
FID5  39.98,1.75 0 top
FID6  37.44,1.75 0 top
FID7  34.9,1.75 0 top
FID8  32.36,1.75 0 top
FID9  29.82,1.75 0 top
FID10  27.28,1.75 0 top
FID11  24.74,1.75 0 top
FID12  22.2,1.75 0 top
IC1  11.11,21.55 0 top
IC2  29.43,65.35 90 top
JP1  15.41,51.28 0 top
LED1  18.2,63.8 180 top
LED2  43.86,40.2 0 top
LED3  45.7,40.65 0 top
Q1  35.17,57.09 90 top
Q2  48.34,63.12 90 top
R1  43.85,37.96 270 top
R2  45.63,38.31 270 top
R3  50,36.6 0 top
R4  18.3,57.7 270 top
R5  18.3,60.8 270 top
R6  42.89,55.08 0 top
R7  52.05,67.96 180 top
R8  39.37,55.08 0 top
R9  32.34,12.35 0 top
R10  44.48,11.61 180 top
R13  27.36,31.3 90 top
R14  24.29,38.16 270 top
R15  2.69,26.44 270 top
R16  30.51,57.08 180 top
R17  2.63,23.02 90 top
TP1  17.21,67.34 90 top
TP2  53.69,54.56 0 top
TP3  13,43.51 0 top
TP5  28.7,51 0 top
TP6  30.9,51 0 top
TP7  50.77,54.51 0 top
TP8  53.49,41.39 90 top
TP9  10.8,43.51 0 top
TP10  26.5,51 0 top
U1  48.43,66.87 270 top
U2  17.82,32.24 180 top
U$2  [2,8]  4.2,4 0 top
U$3  33.1,31.42 0 top
U$4  61,63 90 top
U$5  61,51 90 top
U$6  31.43,45.16 0 top
U$8  12.39,59.65 180 top
U$9  [2,8]  62.75,4 0 top
U$12  61,39.5 90 top
U$23  8.35,66.2 270 top
X2  55.29,20.14 90 top

### Tracks (layer width: path | path; a pad name or v marks a point on that pad's centre or on a via)
!FLASH_CS  (via drill 0.5 pad 0.25)
  Top 0.254: 25.45,27.05 v25.3,26.9 25.4,27 25.4,33.15 24.4,34.15 23.35,34.15 22.75,33.55 22.75,33.05 22.27,32.57 U2.5 | IC1.1 7.3,20.6 v7.35,20.65
  Bottom 0.254: v25.3,26.9 24.9,26.5 18.5,26.5 17.8,27.2 12.1,27.2 11.1,26.2 11.1,24.4 v7.35,20.65
!LED1  (via drill 0.5 pad 0.25)
  Top 0.254: v38.1,40.75 38.55,41.2 43.61,41.2 LED2.C | v30.3,41.45 30.3,43.14 U$6.4
  Bottom 0.254: v38.1,40.75 31,40.75 v30.3,41.45
!LED2
  Top 0.254: U$6.7 32.7,43.15 32.7,42.35 33.2,41.85 45.25,41.85 LED3.C
!TCM_BUSY  (via drill 0.5 pad 0.25)
  Top 0.254: U$6.25 29.34,45.96 v29.55,45.75 | v21.6,39.95 20.85,39.2 | 20.85,39.2 20.15,38.5 20.15,35.61 U2.9 | R14.1 21.24,38.81 20.85,39.2
  Bottom 0.254: v29.55,45.75 29.55,45 28.15,43.6 25.25,43.6 v21.6,39.95
!TCM_CS  (via drill 0.5 pad 0.25)
  Top 0.254: U$6.22 23.16,45.56 22.7,45.1 v21.4,45.1 | v17.1,44.8 17.1,44.4 18.25,43.25 18.25,35.67 U2.12
  Bottom 0.254: v21.4,45.1 17.4,45.1 v17.1,44.8
!TCM_EN  (via drill 0.5 pad 0.25)
  Top 0.254: R16.2 29.5,57.08 v28.88,57.7 24.35,53.17 v24.35,49.45 | v34.22,60.1 35.56,60.1 36.33,59.33 Q1.3 | U$6.26 28.59,45.16 28.25,45.5 28.25,46.65 28.15,46.75 26.8,46.75 26.75,46.7 24.75,46.7 v24.35,47.1
  Bottom 0.254: v28.88,57.7 28.88,58.4 30.59,60.11 v34.21,60.11 v34.22,60.1 | v24.35,47.1 v24.35,49.45
+3V3  (via drill 0.5 pad 0.25)
  Top 0.254: Q1.4 33.86,58.04 32.69,59.21 31.1,59.21 D4.3 31.06,57.18 R16.1 32.52,57.08 v32.65,56.95 | U$6.5 U$6.6 31.83,41.87 33.95,39.75 39.89,39.75 C9.2 C7.2 42.95,38.3 42.95,36.5 43.4,36.05 v43.75,36.05 43.85,35.95 47.75,35.95 48.4,36.6 R3.1 49.35,39.45 51.29,41.39 TP8.TP
  Bottom 0.254: v32.65,56.95 34.25,56.95 44.9,46.3 44.9,37.2 v43.75,36.05
/SPI_DISP_CS
  Top 0.254: X2.41 36.19,27.89 31.05,22.75 20.6,22.75 17.45,25.9 17.45,28.87 U2.28
/TC_RESET  (via drill 0.5 pad 0.25)
  Top 0.254: v24.5,32.55 24.45,32.55 23.25,31.35 21.22,31.35 U2.3
  Bottom 0.254: JP1.5 18.05,49.91 18.05,47.35 17.15,46.45 10.4,46.45 8.9,44.95 8.9,38.45 10.5,36.85 21.9,36.85 24.55,34.2 24.55,32.6 v24.5,32.55
ADC_TEMP  (via drill 0.5 pad 0.25)
  Top 0.254: U2.22 8.72,31.27 v8.7,31.25 | v4.75,28.75 4.4,28.4 4.4,26.8 3.35,25.75 3.15,25.75 | R15.2 2.73,25.75 3.15,25.75 | 3.15,25.75 v3.9,25 | v3.9,22.7 3.9,22.65 3.5,22.25 2.75,22.25 | 2.75,22.25 R17.1 | 2.75,22.25 2.75,20.46 C25.1
  Bottom 0.254: v8.7,31.25 8.25,31.25 6.3,29.3 5.3,29.3 v4.75,28.75 | v3.9,25 v3.9,22.7
BTN_BACKWARD
  Top 0.254: U$6.11 36.63,45.56 50.24,59.17 58.57,59.17 U$4.B U$4.B'
BTN_FORWARD
  Top 0.254: U$6.8 33.43,42.46 33.53,42.36 38.57,42.36 43.74,47.53 58.93,47.53 U$5.B U$5.B'
DC_PWR_EN  (via drill 0.5 pad 0.25)
  Top 0.254: R7.2 U1.1 | U1.1 | U1.1 49.37,68.38 48.5,69.25 46.7,69.25 v46.2,68.75 | 14.43,33.8 U2.18 14.46,33.9 11.4,33.9 10.7,34.6 9.3,34.6 v9.15,34.75
  Bottom 0.254: v46.2,68.75 21.75,68.75 7.4,54.4 7.4,35.5 8.15,34.75 v9.15,34.75
DISCHARGE_VCC  (via drill 0.5 pad 0.25)
  Top 0.254: U2.8 22.88,34.53 24.55,36.2 27.3,36.2 29.85,33.65 29.8,33.65 v29.8,27.45 | v29.8,18.4 29.8,13.4 30.9,12.3 31.64,12.3 R9.1
  Bottom 0.254: v29.8,27.45 v29.8,18.4
DISCHARGE_VDH
  Top 0.254: U2.14 16.86,38.74 15.1,40.5 12.25,40.5 10.85,41.9 10.85,43.46 TP9.TP
DISP_/RESET  (via drill 0.5 pad 0.25)
  Top 0.254: X2.35 36.64,24.89 31.7,19.95 20.05,19.95 v17.95,17.85 | v8.5,30.15 8.8,30.45 13.85,30.45 14,30.6 14.48,30.6 U2.23
  Bottom 0.254: v17.95,17.85 17.95,17.8 14.8,14.65 6.65,14.65 5,16.3 5,26.65 v8.5,30.15
DISP_CLKG
  Top 0.254: X2.44 35.89,29.39 30.55,24.05 20.95,24.05 18.75,26.25 18.75,28.88 U2.30
DISP_OE1
  Top 0.254: X2.42 35.84,28.39 30.85,23.4 20.8,23.4 18.1,26.1 18.1,28.86 U2.29
DISP_STVIN
  Top 0.254: X2.45 35.69,29.89 30.45,24.65 21.1,24.65 19.4,26.35 19.4,28.87 U2.31
DISP_STVOUT
  Top 0.254: X2.46 35.44,30.39 30.3,25.25 21.2,25.25 20.05,26.4 20.05,28.86 U2.32
FLASH_HOLD  (via drill 0.5 pad 0.25)
  Top 0.254: IC1.7 9.84,26.64 v10.45,27.25 | v23.45,28.05 23.45,29.2 22.75,29.9 21.2,29.9 U2.1
  Bottom 0.254: v23.45,28.05 23.4,28.05 23.15,27.8 11,27.8 v10.45,27.25
FLASH_MISO
  Top 0.254: IC1.2 9.84,18.99 11.05,20.2 | 11.05,20.2 11.05,26.2 12.75,27.9 14.52,27.9 U2.25 | X2.37 36.69,25.89 31.45,20.65 16.65,20.65 16.4,20.4 11.25,20.4 11.05,20.2
FLASH_MOSI  (via drill 0.5 pad 0.25)
  Top 0.254: IC1.5 15.81,25.36 16.2,25.75 | 16.2,25.75 U2.26 | X2.38 36.29,26.39 31.3,21.4 v15.1,21.4 | 16.2,25.75 16.15,25.75 15.8,25.4
  Bottom 0.254: v15.1,21.4 14.1,21.4 13.55,21.95 13.55,23.99 IC1.5
FLASH_SCK
  Top 0.254: IC1.6 12.38,24.12 13.5,23 15.25,23 16.85,24.6 | 16.85,24.6 U2.27 | X2.39 36.09,26.89 31.3,22.1 19.35,22.1 16.85,24.6
GND  (via drill 0.5 pad 0.25, 0.6)
  Top 0.254: U$8.2 14.35,59.65 v16,61.3 | U$23.4 U$23.5 9.65,62.07 v9.37,61.79 | U$6.15 31.83,45.56 U$6.28 | U2.20 17.49,32.57 U2.33 | 57.34,25.39 v59.55,27.6 59.25,27.3 59.25,15.35 56,12.1 55.05,12.1 54.4,11.45 53.6,11.45 53.54,11.39 X2.8 | U$6.20 26.39,47.21 v26.05,47.55 | C20.1 47.68,23.87 47.3,24.25 38.1,24.25 35.05,21.2 | X2.40 53.16,27.39 53.2,27.35 53.2,25.45 53.15,25.4 X2.36
  other vias: 3.85,11.2 17.67,10.19 8.8,28.55 35.05,21.3 5.35,47.9 13.85,38.5 52.05,33.95 53.75,39.65 48.4,42.1 42.8,40.25 26,42.05 49.35,33.6 56,22.7 1.8,14.8 20.95,15.05 25.55,12.7 25.8,16.8 17.05,22.55 4.4,34.85 10.65,29.25 61.85,16.7 62.95,23.15 63.3,9.1 61,10.65 62.75,27.65 52.55,45.25 50.9,50.5 35.85,51.45 41.1,52.85 44.85,50.55 25.35,59.1 3.1,58.15 5.7,56.55 1.45,45.7 2.1,39.9 45.05,61.3 53.65,63.35 52.25,61.05
  pour Top: -4.4,71.15 73.2,70.5 73.2,-12.5 -4.4,-11.85
  pour Bottom: -5.35,70.8 73.1,70.8 73.1,-11.3 -5.35,-11.3
N$1
  Top 0.254: U$6.18 29.43,47.33 27.09,49.67 26.82,49.67 26.51,49.98 TP10.TP
N$5  (via drill 0.5 pad 0.25)
  Top 0.254: U$23.1 7.05,60.52 C6.1 10.88,60.37 U$8.4 12.19,60.59 v12.3,60.7 | v16.1,64.5 18.15,64.5 LED1.A
  Bottom 0.254: v12.3,60.7 v16.1,64.5
N$6
  Top 0.254: C37.+ 39.28,65.71 37.39,65.71 36.39,64.71 C22.2 IC2.2 IC2.1 32.03,61.47 D4.1
N$7
  Top 0.254: R4.2 11.74,57.05 11.09,57.7 U$8.5
N$8
  Top 0.254: LED1.C 18.2,61.55 R5.1
N$9
  Top 0.254: C20.2 49.93,23.87 50.4,23.4 X2.32
N$10
  Top 0.254: R5.2 17.65,60.15 16.2,58.7 U$8.1
N$11
  Top 0.254: U1.3 48.91,65.78 49.56,65.13 49.56,64.13 Q2.3 49.94,64.07 50.43,63.58 50.43,61.41 48,58.98 45.21,58.98 43.57,57.34 43.57,55.11 R6.2
N$12
  Top 0.254: R8.2 R6.1 42.28,55.12 42.28,58.17 43.89,59.78 C4.+ 43.94,64.07 Q2.4
N$13
  Top 0.254: X2.29 50.96,21.89 49.8,23.05 46.89,23.05 C10.1
N$14
  Top 0.254: X2.28 50.61,21.39 49.55,22.45 45.5,22.45 45.3,22.65 C10.2
N$15
  Top 0.254: X2.27 50.21,20.89 49.25,21.85 44.42,21.85 C11.1
N$16
  Top 0.254: X2.26 49.91,20.39 49.15,21.15 43.82,21.15 C11.2
N$17
  Top 0.254: X2.25 49.51,19.89 48.75,20.65 43.15,20.65 42.45,21.35 40.54,21.35 C12.1
N$18
  Top 0.254: X2.24 48.96,19.39 48.25,20.1 40.45,20.1 C12.2
N$19
  Top 0.254: U$6.3 29.43,39.15 U$3.4 33.52,35.06 C2.2
N$20
  Top 0.254: U$6.2 28.63,35.88 C1.2 33.09,32.81 U$3.1
N$21
  Top 0.254: X2.23 48.11,18.89 47.5,19.5 38.23,19.5 C13.1
N$22
  Top 0.254: X2.22 47.56,18.39 47,18.95 37.48,18.95 C13.2
N$24
  Top 0.254: X2.21 37.82,17.89 C14.1
N$25
  Top 0.254: X2.20 38.99,17.39 38.55,16.95 36.9,16.95 36.45,17.4 36.45,17.96 C14.2
N$26
  Top 0.254: X2.19 41.57,16.89 C15.1
N$27
  Top 0.254: X2.17 45.95,15.89 C16.1
N$28
  Top 0.254: X2.16 47.19,15.39 46.3,14.5 44.35,14.5 44.2,14.65 44.2,15.44 C16.2
N$29
  Top 0.254: X2.15 47.64,14.89 46.75,14 37.09,14 C17.1
N$30
  Top 0.254: X2.14 47.89,14.39 47,13.5 38.75,13.5 38.15,12.9 36.05,12.9 35.7,13.25 35.7,13.85 C17.2
N$31
  Top 0.254: X2.13 48.14,13.89 47.2,12.95 41.47,12.95 C38.1
N$32
  Top 0.254: X2.12 48.34,13.39 47.4,12.45 42.8,12.45 41.85,11.5 40.15,11.5 39.8,11.85 39.8,12.58 C38.2
N$33
  Top 0.254: LED2.A 43.86,38.8 R1.1
N$34
  Top 0.254: LED3.A 45.7,38.85 R2.1
N$36
  Top 0.254: C18.2 38.49,10.9 42.1,10.9 42.81,11.61 R10.2 43.83,10.77 43.88,10.77 46.85,7.8 51.95,7.8 X2.1 53.04,7.89 53.25,8.1 53.25,8.65 53,8.9 X2.3
N$37
  Top 0.254: X2.11 48.59,12.89 47.6,11.9 45.42,11.9 R10.1
N$38  (via drill 0.5 pad 0.25)
  Top 0.254: U$6.23 23.26,44.76 v22.35,43.85 | v15.7,43.5 12.82,43.5 TP3.TP
  Bottom 0.254: v22.35,43.85 16.05,43.85 v15.7,43.5
N$39
  Top 0.254: X2.18 43.14,16.39 42.6,15.7 40.2,15.7 40.05,16 40.05,16.59 C15.2
N$44
  Top 0.254: U$6.13 U$6.14
SWCLK
  Top 0.254: U$6.17 30.23,47.61 28.75,49.09 28.75,50.95 TP5.TP
SWDIO  (via drill 0.5 pad 0.25)
  Top 0.254: U$6.16 31.03,48 | 31.03,48 31.03,50.87 TP6.TP | v42.9,43 43,42.9 U$12.B' U$12.B 58.5,35.6 53.85,35.6 53.44,36.01 53.44,36.1 C3.1 50.71,36.54 R3.2 | v36.9,48.85 31.88,48.85 31.03,48
  Bottom 0.254: v42.9,43 42.75,43 v36.9,48.85
TC_BOOT/DISCHARGE_VDL  (via drill 0.5 pad 0.25)
  Top 0.254: U2.2 23.69,30.61 v23.75,30.55 | v26.4,29.45 26.85,29.45 27.4,30 27.4,30.61 R13.1 28.35,31.64 v28.35,33.8 | JP1.2 12.87,52.48 14.15,51.2 14.15,45.85 v14.7,45.3
  Bottom 0.254: v23.75,30.55 23.75,30.2 24.5,29.45 v26.4,29.45 | v14.7,45.3 14.7,39.05 15.35,38.4 23.75,38.4 v28.35,33.8
TC_RXD  (via drill 0.5 pad 0.25)
  Top 0.254: v9.55,47.35 6.8,47.35 v4.8,45.35 | v6.05,37.15 7.95,37.15 9.9,35.2 11.95,35.2 v12.15,35 | v12.45,29.15 13.69,29.15 U2.24
  Bottom 0.254: JP1.3 15.41,47.56 15.2,47.35 v9.55,47.35 | v4.8,45.35 4.8,38.4 v6.05,37.15 | v12.15,35 12.15,29.45 v12.45,29.15
TC_TXD  (via drill 0.5 pad 0.25)
  Top 0.254: v23.65,33.3 23.65,33.2 22.4,31.95 21.19,31.95 U2.4
  Bottom 0.254: JP1.4 13.96,51.1 11.35,51.1 8.25,48 8.25,38.2 10.15,36.3 21.6,36.3 23.65,34.25 v23.65,33.3
TCM_MISO
  Top 0.254: U$6.19 28.63,47.26 27.53,48.36 22.7,48.36 19.48,45.14 19.48,35.6 U2.10
TCM_MOSI  (via drill 0.5 pad 0.25)
  Top 0.254: U$6.21 v22.56,46.36 v22.55,46.35 | v18.25,45.95 18.25,45.65 18.85,45.05 18.85,35.63 U2.11
  Bottom 0.254: v22.55,46.35 18.65,46.35 v18.25,45.95
TCM_SCLK  (via drill 0.5 pad 0.25)
  Top 0.254: U$6.27 24.61,44.36 22.7,42.45 v21.45,42.45 | v16.05,42 16.05,41.6 17.55,40.1 17.55,35.63 U2.13
  Bottom 0.254: v21.45,42.45 16.5,42.45 v16.05,42
VBATT
  Top 0.254: U$8.3 13.69,63.81 TP1.TP 23.41,67.34 C23.2 23.5,67.25 IC2.5 26.91,67.17 27.82,67.17 28.36,66.63 28.36,64 27.8,63.44 IC2.8
VCC  (via drill 0.5 pad 0.25)  (1 unrouted)
  Top 0.254: Q2.1 48.72,62.17 v47,60.45 | X2.43 52.95,28.9 | 52.95,28.9 56.85,25 56.85,15.5 53.75,12.4 X2.10 X2.9 51.26,11.89 51.1,12.05 48.55,12.05 46.7,10.2 v45.95,10.2 | v48.4,32.75 49.25,31.9 50,31.9 | 50,31.9 X2.49 55.36,31.89 56.15,31.1 56.15,29.5 55.55,28.9 52.95,28.9 | C5.2 50.64,32.54 50,31.9 | 37.86,10.15 C39.2 | C39.2 37.6,9.65 36.65,8.7 34.14,8.7 C19.2 32.95,12.31 R9.2 | v41.9,10.1 37.81,10.1 C39.2
  Bottom 0.254: v47,60.45 47,34.15 v48.4,32.75 | 42.65,10.2 42.6,10.15 | v45.95,10.2 42,10.2 v41.9,10.1
VDD  (via drill 0.5 pad 0.25)
  Top 0.254: Q1.5 Q1.6 33.97,56.1 | 36.4,56.14 Q1.1 37.39,55.08 R8.1 | 33.97,56.1 36.48,56.1 36.5,56.08 | U2.21 14.43,31.85 10,31.85 9.25,32.6 8.45,32.6 v7.05,31.2 | IC1.3 12.38,17.53 | 12.38,17.53 10.15,15.3 7.2,15.3 5.1,17.4 5.1,22.65 | 5.1,22.65 5.1,24.05 6.3,25.25 7.19,25.25 IC1.8 7.3,30.95 v7.05,31.2 | 33.97,56.1 31.65,56.1 v30.4,54.85 | v10.15,52.9 10.15,50.85 11,50 | 11,50 JP1.1 | 11,50 6.1,50 | 6.1,50 3.55,47.45 3.55,40.3 | 3.55,40.3 3.55,38.05 v7.35,34.25 | v7.05,31.2 5.4,31.2 | 6.1,50 6.1,51.56 C31.1 3.21,51.8 C32.1 | C35.1 4.2,32.4 5.4,31.2 | C36.1 3.16,28.96 5.4,31.2 | R13.2 27.36,33.24 v25.7,34.9 | v10.75,38.35 5.5,38.35 3.55,40.3 | U2.19 11.24,33.2 10.5,33.95 7.65,33.95 v7.35,34.25 | 7.55,34.05 v7.35,34.25 | 7.6,34 v7.35,34.25 | R17.2 4.08,23.67 5.1,22.65 | R14.2 23.61,37.51 v23.05,36.95 | 12.38,17.53 12.38,13.16 C26.1 10.39,12.99 C24.1
  Bottom 0.254: v7.35,34.25 6.45,34.25 6.25,34.05 6.25,32 v7.05,31.2 | v30.4,54.85 12.1,54.85 v10.15,52.9 | v25.7,34.9 25.1,34.9 v23.05,36.95 22.45,37.55 11.55,37.55 v10.75,38.35
VDH  (via drill 0.5 pad 0.25)
  Top 0.254: X2.5 50.29,9.89 49.9,9.5 49.05,9.5 v48.9,9.35 | v45.95,6.4 44.67,6.4 C33.2
  Bottom 0.254: v48.9,9.35 v45.95,6.4
VDL  (via drill 0.5 pad 0.25)
  Top 0.254: X2.4 50.89,9.39 v50.15,8.65 | v47.1,3.9 C34.2
  Bottom 0.254: v50.15,8.65 47.95,6.45 47.95,4.75 v47.1,3.9
VGH  (via drill 0.5 pad 0.25)
  Top 0.254: C21.2 47.05,32.69 47.05,31.9 47.56,31.39 X2.48 53.61,31.39 v54.1,30.9 | v55.35,10.9 X2.7 | X2.7 | X2.7 50.9,10.9 v50.65,11.15 | v40.35,9.15 38.4,9.15 37.2,7.95 32.9,7.95 C40.2
  Bottom 0.254: v54.1,30.9 54.1,26.25 53.65,25.8 53.65,15.85 56,13.5 56,11.55 v55.35,10.9 | v50.65,11.15 48.25,11.15 46.5,9.4 42.55,9.4 42.3,9.15 v40.35,9.15
VGL  (via drill 0.5 pad 0.25)
  Top 0.254: C8.2 47.07,30.89 X2.47 52.96,30.89 53.85,30 55,30 v55.05,29.95 | v55.3,9.3 54.75,9.3 53.65,10.4 X2.6 | X2.6 | v49.55,10.35 50.85,10.35 50.9,10.4 X2.6 | v39.3,8.1 38.75,8.1 37.4,6.75 32.92,6.75 C41.2 32.72,6.12 31.15,4.55 26.2,4.55 25.4,5.35 25.4,6.48 D5.A
  Bottom 0.254: v55.05,29.95 55.05,15.95 56.95,14.05 56.95,10.95 v55.3,9.3 | v49.55,10.35 48.35,10.35 46.65,8.65 43,8.65 42.45,8.1 v39.3,8.1
VSYS
  Top 0.254: R1.2 45.28,37.48 R2.2

### Text on the board
Top: Epaper v1